# Altium schematic sheet QCopterFC_IMU_Sch.SchDoc
size A4
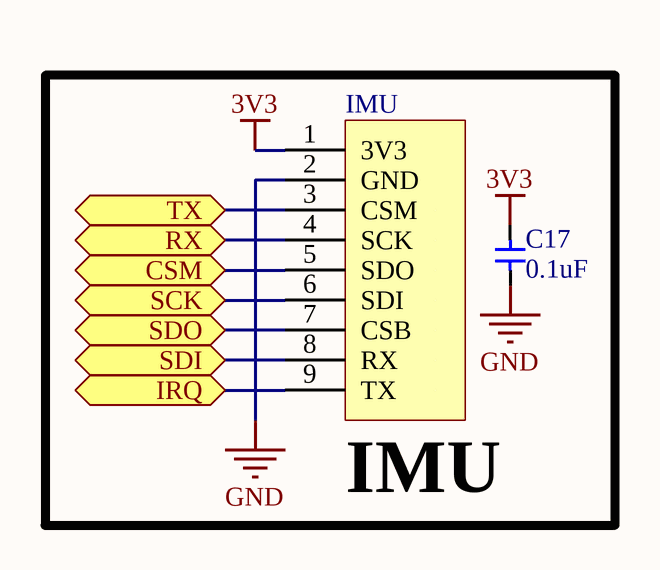
[diagram p0: QCopterFC_IMU_Sch.SchDoc]

## Parts
C17  value 0.1uF  [CAP_0603]  (hidden comment: Cap_0603)
IMU  SmartIMU  [SMART_IMU]  (value not drawn)

## Blocks framed on the sheet
IMU: C17 IMU

## Ports
CSM, IRQ, RX, SCK, SDI, SDO, TX

## Nets
3V3: C17.2 IMU.1(3V3)
GND: C17.1 IMU.2(GND)
CSM: IMU.5(SDO) ; port CSM
IRQ: IMU.9(TX) ; port IRQ
RX: IMU.4(SCK) ; port RX
SCK: IMU.6(SDI) ; port SCK
SDI: IMU.8(RX) ; port SDI
SDO: IMU.7(CSB) ; port SDO
TX: IMU.3(CSM) ; port TX

Not connected (* = marked no-connect by the designer): IMU 10(NC) 11(NC) 12(NC) 13(NC) 14(NC) 15(NC) 16(NC)

## Library data of the parts
C17 = Cap_0603: Capacitor
IMU = SmartIMU: Module